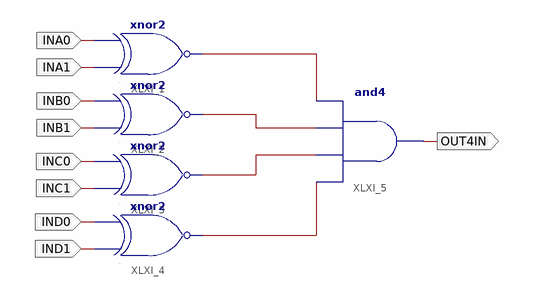
[diagram p0: schematic sheet 1]
// Xilinx ISE schematic CheckCompare.sch (spartan6) as structural Verilog: 5 symbols, 9 ports
module CheckCompare (
  input  INA0,
  input  INA1,
  input  INB0,
  input  INB1,
  input  INC0,
  input  INC1,
  input  IND0,
  input  IND1,
  output OUT4IN
);

  wire XLXN_1, XLXN_2, XLXN_3, XLXN_4;

  xnor XLXI_1 (XLXN_1, INA1, INA0);
  xnor XLXI_2 (XLXN_2, INB1, INB0);
  xnor XLXI_3 (XLXN_3, INC1, INC0);
  xnor XLXI_4 (XLXN_4, IND1, IND0);
  and XLXI_5 (OUT4IN, XLXN_4, XLXN_3, XLXN_2, XLXN_1);
endmodule
